# EAGLE design 0127_microphone_type_J_102 (EAGLE 9.2.2)
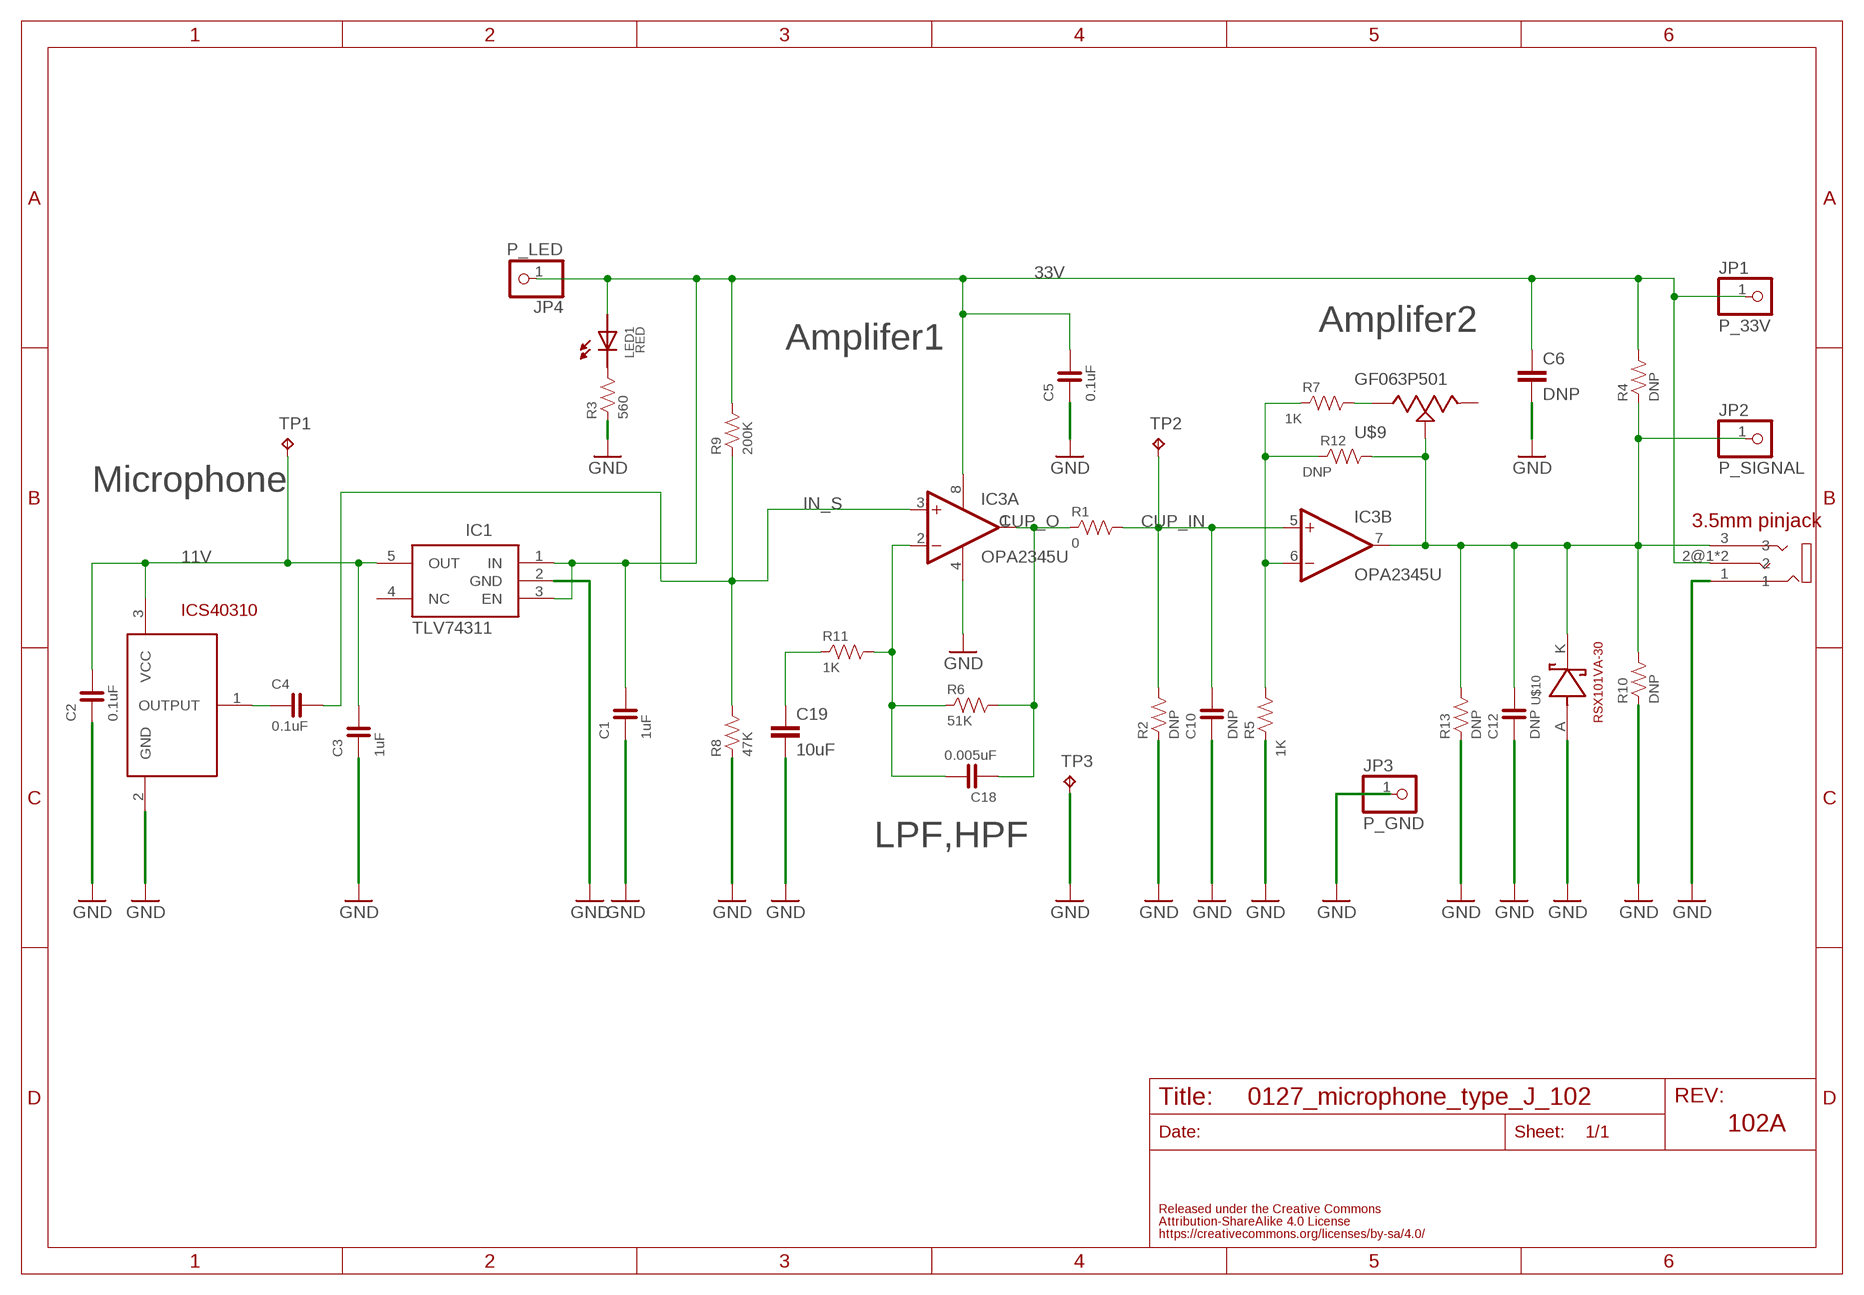
[diagram p0: schematic, sheet 1]

## Parts
C1  1uF  CAPACITOR-0603  [0603]
C2  0.1uF  CAPACITOR-0603  [0603]
C3  1uF  CAPACITOR-0603  [0603]
C4  0.1uF  CAPACITOR-0603  [0603]
C5  0.1uF  CAPACITOR-0603  [0603]
C6  DNP  C-EUC1206K  [C1206K]
C10  DNP  CAPACITOR-0603  [0603]
C12  DNP  CAPACITOR-0603  [0603]
C18  0.005uF  CAPACITOR-0603  [0603]
C19  10uF  C-EUC1206K  [C1206K]
IC1  TLV74311  [SOT-23-5]
IC3  OPA2345U  [SO08]
ICS40310  ANALOG-MICICS40310  [ICS40310]
JP1  P_33V  PINHD-1X1  [1X01]
JP2  P_SIGNAL  PINHD-1X1  [1X01]
JP3  P_GND  PINHD-1X1  [1X01]
JP4  P_LED  PINHD-1X1  [1X01]
LED1  RED  LED-0603-NARROW  [0603-NARROW]
R1  0  RESISTOR-0603  [0603]
R2  DNP  RESISTOR-0603  [0603]
R3  560  RESISTOR-0603  [0603]
R4  DNP  RESISTOR-0603  [0603]
R5  1K  RESISTOR-0603  [0603]
R6  51K  RESISTOR-0603  [0603]
R7  1K  RESISTOR-0603  [0603]
R8  47K  RESISTOR-0603  [0603]
R9  200K  RESISTOR-0603  [0603]
R10  DNP  RESISTOR-0603  [0603]
R11  1K  RESISTOR-0603  [0603]
R12  DNP  RESISTOR-0603  [0603]
R13  DNP  RESISTOR-0603  [0603]
TP1  TPB1,27  [B1,27]
TP2  TPB1,27  [B1,27]
TP3  TPB1,27  [B1,27]
U$9  GF063P501  [GF063P103]
U$10  RSX101VA-30  [RSX101VA-30]
U$11  MJ8435  [MJ8435]

## Nets
11V: C2.2 C3.2 IC1.5(OUT) ICS40310.3(VCC) TP1.TP
33V: C1.2 C5.2 C6.1 IC1.1(IN) IC1.3(EN) IC3.8(A:V+) JP1.1 JP4.1 LED1.ANODE R4.2 R9.2 U$11.2@1 U$11.2@2
CUP_IN: C10.2 IC3.5(B:+IN) R1.2 R2.2 TP2.TP
CUP_O: C18.1 IC3.1(A:OUT) R1.1 R6.2
FB1: C18.2 IC3.2(A:-IN) R6.1 R11.2
FB2: IC3.6(B:-IN) R5.2 R7.1 R12.1
GND: C1.1 C2.1 C3.1 C5.1 C6.2 C10.1 C12.1 C19.2 IC1.2(GND) IC3.4(A:V-) ICS40310.2(GND) JP3.1 R2.1 R3.1 R5.1 R8.1 R10.1 R13.1 TP3.TP U$10.A(ANODE) U$11.1
IN_S: C4.2 IC3.3(A:+IN) R8.2 R9.1
MIC_O: C4.1 ICS40310.1(OUTPUT)
N$5: LED1.CATHODE R3.2
N$7: C19.1 R11.1
N$10: R7.2 U$9.3
OUT_S: C12.2 IC3.7(B:OUT) JP2.1 R4.1 R10.2 R12.2 R13.2 U$9.2 U$10.K(CATHODE) U$11.3
Unconnected: IC1.4(NC) U$9.1

## Notes on the sheet
- Amplifer2
- Amplifer1
- Microphone
- 3.5mm pinjack
- ICS40310
- LPF,HPF
- 102A

## Library data of the parts
C1-C5 C18 = FaBo-Capacitor:CAPACITOR: CAPACITOR
C6 C19 = rcl:C-EU: CAPACITOR, European symbol; SPICEPREFIX: C
C10 C12 = FaBo-Capacitor:CAPACITOR: CAPACITOR; SPICEPREFIX: C
IC1 = FaBo-Supply:TLV74311
IC3 = linear:OPA2*: Dual Operational Amplifier Low Power, Single-Supply, Rail-To-Rail Operational Amplifier Source: http://focus.ti.com/lit/ds/symlink/opa2345.pdf http://focus.ti.com .. opa241.pdf http://focus.ti.com/lit/ds/symlink/opa2134.pdf
ICS40310 = FaBo-Sound:ANALOG-MIC
JP1-JP4 = pinhead:PINHD-1X1: PIN HEADER
LED1 = FaBo-LED:LED
R1-R13 = FaBo-Resistors:RESISTOR: RESISTOR
TP1-TP3 = testpad:TP: Test pad
U$9 = FaBo-Resistors:GF063P501
U$10 = FaBo-Diode:RSX101VA-30
U$11 = FaBo-Sound:MJ8435

## Board
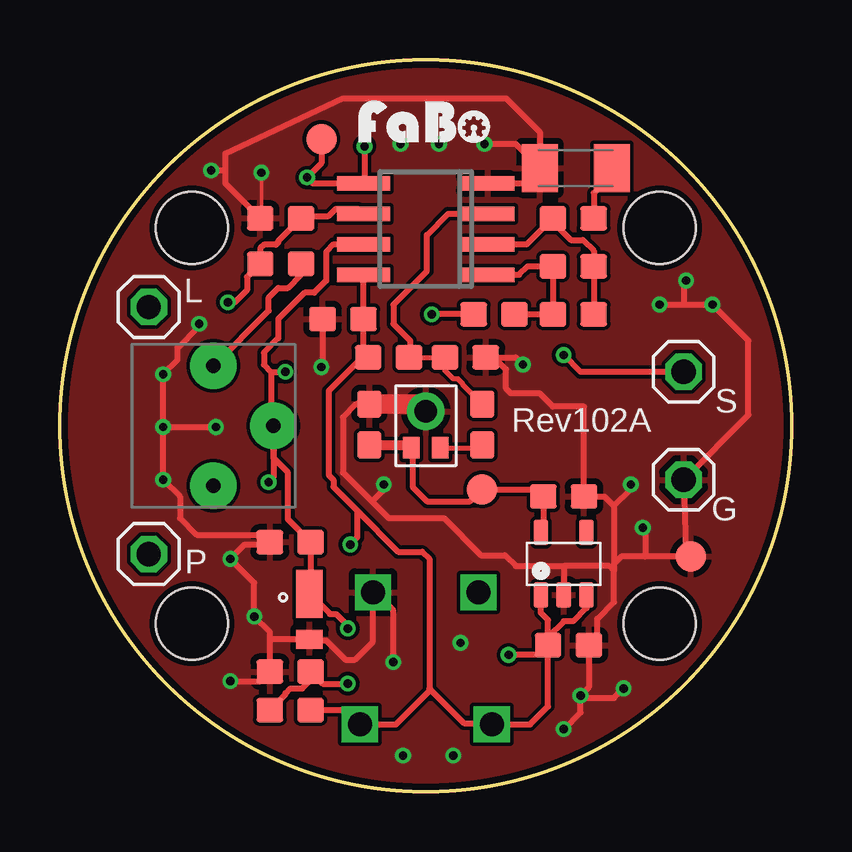
[diagram p1: board, top side]
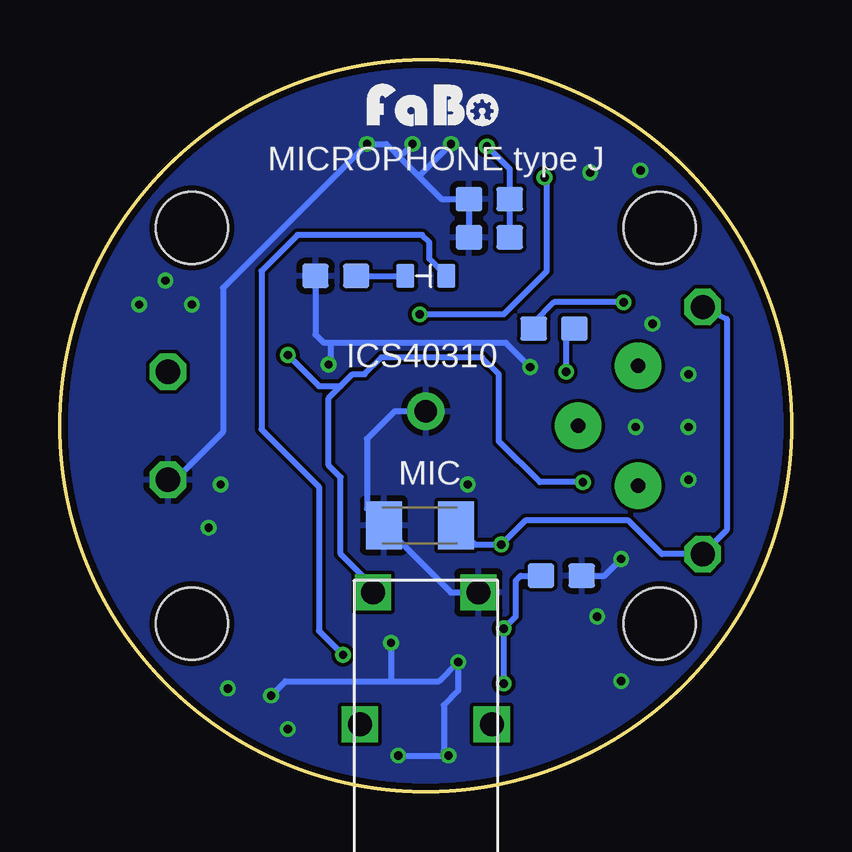
[diagram p2: board, bottom side, seen from below]

Size 30.5 x 30.5 mm. Coordinates in mm from the lower left corner, seen from the top.
Outline: circle at 15.25,15.25 radius 15.25
Copper layers (1*16): Top 0.035mm / dielectric 1.5mm / Bottom 0.035mm
Design rules "SeeedStudio_2layer_DRU_no_angle_20140221": minimum track width 6mil, minimum drill 12mil, track to track 6mil, track to pad 6mil, pad to pad 6mil, via to via 6mil, smd to smd 0mil, copper to edge 10mil, drill to drill 10mil, minimum pad ring 10mil, minimum via ring 6mil, stop-mask expansion 2mil, vias tented up to drill 100mil, thermal gap 10mil
Holes 3 mm at 5.5,23.5 25,23.5 5.5,7 25,7

### Footprints (pad centres in the part's own frame; a part is rotated, then mirrored left to right if it is on the bottom)
0603 = smd 1.1 x 1: 1 -0.85,0; 2 0.85,0
C1206K = smd 1.5 x 2: 1 -1.5,0; 2 1.5,0
SOT-23-5 = smd 0.6 x 1.05: 1 -0.95,-1.3; 2 0,-1.3; 3 0.95,-1.3; 4 0.95,1.3; 5 -0.95,1.3
SO08 = smd 0.6 x 2.2: 1 -1.905,-2.6; 2 -0.635,-2.6; 3 0.635,-2.6; 4 1.905,-2.6; 5 1.905,2.6; 6 0.635,2.6; 7 -0.635,2.6; 8 -1.905,2.6
ICS40310 = smd 0.68 x 0.9: 1 -0.61,0.92; 3 0.61,0.92 | drill 0.95 pad 1.55: 2 0,-0.6
1X01 = drill 1.016 octagon: 1 0,0
0603-NARROW = smd 0.75 x 1: ANODE -0.85,0; CATHODE 0.85,0
B1,27 = smd 1.27 x 1.27: TP 0,0
GF063P103 = drill 0.6 pad 1.93: 1 2.5,0; 2 0,2.5; 3 -2.5,0
RSX101VA-30 = smd 1.1 x 0.8: A 0,-1.25 | smd 1.1 x 2: K 0,0.65
MJ8435 = drill 1 square: 1 -2.2,-6.5; 2@1 2.75,-1; 2@2 -2.75,-1; 3 2.2,-6.5

### Placement (x,y rotation side)
C1  21.2,6.1 180 top
C2  12.9,15.3 270 top
C3  21,12.3 180 top
C4  17.6,15.3 90 top
C5  11.8,19.7 0 top
C6  15.5,11.1 180 bottom
C10  12.6,23.1 0 bottom
C12  9.6,5 0 top
C18  21.4,19.9 0 top
C19  21.5,26 180 top
IC1  21,9.5 0 top
IC3  15.25,23.45 90 top
ICS40310  15.25,15.25 180 top
JP1  3.7,9.9 0 top
JP2  26,17.5 0 top
JP3  26,13 0 top
JP4  3.7,20.2 0 top
LED1  15.25,21.5 180 bottom
R1  18.1,19.9 180 top
R2  12.6,24.7 0 bottom
R3  19,21.5 0 bottom
R4  9.6,3.4 0 top
R5  9.2,23.9 0 top
R6  21.4,21.9 180 top
R7  9.2,22 0 top
R8  16.9,18.1 180 top
R9  13.7,18.1 180 top
R10  9.6,9 180 bottom
R11  21.4,23.9 180 top
R12  9.9,19.3 0 bottom
R13  9.6,10.4 0 top
TP1  17.6,12.6 0 top
TP2  10.9,27.2 0 top
TP3  26.3,9.8 0 top
U$2  [LOGO_FABO_S]  14.9,27.6 0 bottom
U$8  [LOGO_FABO_S]  15.25,26.9 0 top
U$9  6.4,15.25 270 top
U$10  10.4,7.6 0 top
U$11  15.25,1.8 180 bottom

### Tracks (layer width: path | path; a pad name or v marks a point on that pad's centre or on a via)
11V
  Top 0.254: ICS40310.3 14.7,14.27 14.7,12.7 15.3,12.1 17.1,12.1 TP1.TP 19.7,12.6 20.07,12.22 C3.2 20.15,10.9 IC1.5
  Top 0.406: C2.2 14.52,14.45 ICS40310.3
33V  (via drill 0.35)
  Top 0.254: C1.2 20.35,3.55 19.6,2.8 U$11.2@1 17.95,2.85 16.85,2.85 15.45,4.25 | C1.2 20.35,6.45 | 20.35,6.45 20.35,7.15 20.05,7.45 IC1.1 | IC1.3 21.95,7.65 21.4,7.1 21,7.1 20.35,6.45 | 12.4,11.7 11.4,12.7 11.4,13 11.2,13.2 11.2,16.7 12.6,18.1 R9.2 12.65,18.3 C5.2 IC3.8 | 12.4,11.7 14.1,10 15.1,10 15.4,9.7 15.4,4.3 15.45,4.25 | 15.45,4.25 14,2.8 U$11.2@2 11.9,3.4 R4.2 | C1.2 19.95,5.7 v18.7,5.7 | v12.1,10.3 12.4,10.6 12.4,11.7
  Bottom 0.254: LED1.ANODE 15.1,22.2 15.1,22.9 15.4,23.2 20.6,23.2 22.1,21.7 22.1,15.1 19.7,12.7 19.7,6.7 v18.7,5.7 | JP4.1 2.7,19.7 2.7,10.9 JP1.1 5.4,9.9 6.8,11.3 11.1,11.3 v12.1,10.3 13.2,10.3 C6.1
CUP_IN  (via drill 0.35)
  Top 0.254: R1.2 v15.5,19.9 | TP2.TP 10.9,26.2 v10.3,25.6 10.54,25.36 IC3.5 12.7,25.41 v12.7,26.9
  Bottom 0.254: v15.5,19.9 12,19.9 10.2,21.7 10.2,25.5 v10.3,25.6 | v12.7,26.9 11.75,25.95 R2.2 C10.2
CUP_O
  Top 0.254: IC3.1 19.14,21.55 19.5,21.9 R6.2 C18.1 R1.1
FB1
  Top 0.254: IC3.2 19.46,22.82 R11.2 20.55,23.75 21.3,23 21.8,23 22.25,22.55 R6.1 C18.2
FB2  (via drill 0.35)
  Top 0.254: IC3.6 12.44,24.3 11.5,24.3 11.2,24 10.15,24 R5.2 9.1,22.95 9.1,22.9 9,22.8 8.5,22.8 8.35,22.65 R7.1 7.8,21.45 7.8,20.9 7.3,20.4 v7,20.4
  Bottom 0.254: v7,20.4 9.9,20.4 10.75,19.55 R12.1
GND  (via drill 0.35)
  Top 0.152: v8.4,25.8 8.4,23.95 R5.1
  Top 0.254: IC3.4 19.36,25.36 C19.2 | C2.1 12.35,16.15 11.8,15.6 11.8,13.3 13,12.1 | 13,12.1 13.7,11.4 16,11.4 17.55,9.85 18.55,9.85 19,9.4 21,9.4 | 23.1,9.2 23.1,7.9 22.4,7.2 22.4,6.45 C1.1 22.05,4.35 v21.7,4 | 23.1,9.2 22.9,9.4 21,9.4 | 21,9.4 IC1.2 | 23.1,11.9 22.7,12.3 C3.1 21.85,16.05 20.55,16.05 20,16.6 18.8,16.6 18.6,16.8 18.6,17.6 18.1,18.1 | 23.1,11.9 23.1,9.5 | 23.1,9.5 23.1,9.2 | R13.1 8.75,10.3 8.6,10.3 | 8.6,10.3 7.7,10.3 v7.1,9.7 8.1,8.7 v8.1,7.3 8.75,6.65 8.75,6.4 | v13.5,12.8 13.5,12.6 13,12.1 | v13.9,5.4 13.9,7.55 13.05,8.4 U$11.1 13.05,6.25 12.3,5.5 11.9,5.5 11.1,6.3 10.45,6.3 U$10.A 8.8,6.35 8.75,6.4 | 24.4,9.8 TP3.TP 26.1,10 JP3.1 28.7,15.7 28.7,18.8 v27.2,20.3 26,20.3 | 24.4,9.8 23.4,9.8 23.1,9.5 | C19.2 19,27 v17.7,27 | R5.1 6.9,25.35 6.9,25.9 | 6.9,25.9 6.9,26.6 11.83,28.9 18.6,28.9 20,27.5 C19.2 | C5.1 10.95,17.75 v10.9,17.7 | R8.1 18.1,18.1 | 18.1,18.1 19,18.1 v19.3,17.8 | v4.3,15.2 v4.3,13 5,12.3 5,11.4 5.7,10.7 8.2,10.7 8.6,10.3 | v4.3,15.2 v4.3,17.4 4.9,18 4.9,18.5 5.8,19.4 v5.8,19.5 | v4.3,15.2 v6.5,15.2 | v25,20.3 26,20.3 | v26.1,21.3 26,21.2 26,20.3 | 23.1,11.9 23.8,12.6 v23.8,12.8 | v24.3,11 24.4,10.9 24.4,9.8 | v6.3,25.9 6.9,25.9 | 8.75,6.4 C12.1 8.35,4.6 v7.1,4.6 | v21,2.6 21.7,3.3 v21.7,4 | v21.7,4 21.8,3.9 23.1,3.9 v23.5,4.3
  Top 0.813: C2.1 14.95,16.15 ICS40310.2
  Bottom 0.254: R10.1 7.8,9 v7.1,9.7 | v21.7,4 21.1,4.6 16.7,4.6 | 16.7,4.6 14.7,4.6 v13.9,5.4 13.9,4.2 14.5,3.6 14.5,1.7 v14.3,1.5 v16.4,1.5 | U$11.1 14.2,8.3 C6.2 17.7,11.8 17.7,14.7 16.55,15.85 ICS40310.2 | 16.5,26.6 16.9,27 v17.7,27 23.7,21 23.7,15 25.7,13 JP3.1 | 16.5,26.6 15.5,25.6 | 15.5,25.6 14.6,24.7 R2.1 C10.1 | v10.9,17.7 11.9,18.7 19.2,18.7 | 19.2,18.7 19.5,18.7 19.85,19.05 R3.1 | v19.3,17.8 19.2,17.9 19.2,18.7 | v16.7,6.2 16.7,4.6 | v15.8,27 16.2,26.6 16.5,26.6 | v14.2,27 15.5,25.7 15.5,25.6
  pour Top: 0.1,0 30.5,0 30.5,30.5 0,30.5 0,0
  pour Bottom: 0,0 30.5,0 30.5,30.5 0,30.5
IN_S
  Top 0.203: C4.2 16.8,16.95 16.8,17 16.6,17.2 16.4,17.2 16.05,17.55 R8.2 R9.1
  Top 0.254: R9.1 14.6,18.15 14.6,18.8 13.9,19.5 13.9,20.3 15.3,21.7 15.3,23.2 16.18,24.09 IC3.3
MIC_O
  Top 0.203: ICS40310.1 17.48,14.33 C4.1
N$5
  Bottom 0.254: R3.2 LED1.CATHODE
N$7
  Top 0.254: C19.1 23,25.7 22.25,24.95 R11.1
N$10
  Top 0.254: U$9.3 8.7,20.05 8.7,20.6 9.1,21 9.5,21 10.05,21.55 R7.2
OUT_S  (via drill 0.35)
  Top 0.254: IC3.7 11.41,22.82 11.1,22.5 11.1,21.3 10.6,20.8 10.2,20.8 9.1,19.7 9.1,18.9 8.5,18.3 8.5,17.8 8.8,17.5 | R4.1 9.4,4.05 9.4,4.1 9.6,4.3 10.1,4.3 10.45,4.65 C12.2 10.95,4.5 v12,4.5 | U$9.2 8.9,13.1 v8.7,12.9 | JP2.1 21.7,17.5 v21,18.2 | 8.8,17.5 v9.4,17.5 | 8.8,17.5 8.8,15.35 U$9.2 | U$9.2 8.9,13.9 9.5,13.3 9.5,11.35 R13.2 10.45,8.3 U$10.K 11.25,7.4 11.5,7.4 12,6.9 v12,6.8
  Bottom 0.254: R12.2 9.4,18.95 v9.4,17.5 | v8.7,12.9 10.5,12.9 12.2,14.6 12.2,17.4 12.9,18.1 17.1,18.1 17.8,17.4 18.3,17.4 18.8,16.9 | U$11.3 17.45,8.55 18.8,9.9 18.8,13.1 19.3,13.6 19.3,16.4 18.8,16.9 | v21,18.2 19.7,16.9 18.8,16.9 | R10.2 11.3,9 11.5,8.8 11.5,7.3 v12,6.8 v12,4.5

### Text on the board
tPlace: L | S | Rev102A | G | P
bPlace: MICROPHONE type J | MIC